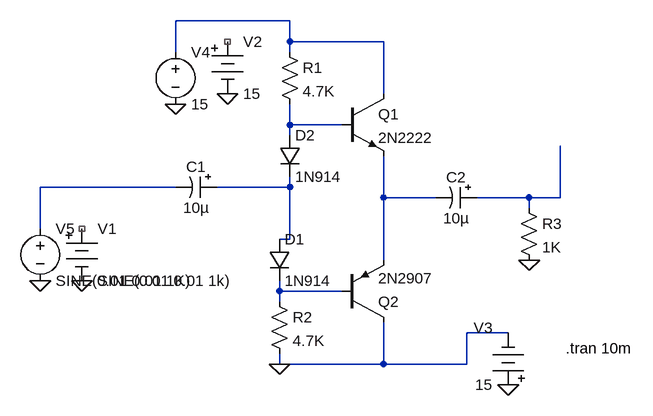
[diagram p0: schematic class b diode experiment 6.asc]
class b diode experiment 6.asc, the LTspice schematic file:
Version 4
SHEET 1 880 680
WIRE 320 -16 144 -16
WIRE 320 16 320 -16
WIRE 464 16 320 16
WIRE 144 32 144 -16
WIRE 320 32 320 16
WIRE 464 96 464 16
WIRE 320 144 320 112
WIRE 400 144 320 144
WIRE 320 160 320 144
WIRE 144 240 -64 240
WIRE 320 240 320 224
WIRE 320 240 208 240
WIRE 464 256 464 192
WIRE 544 256 464 256
WIRE 688 256 608 256
WIRE 736 256 736 176
WIRE 736 256 688 256
WIRE 688 272 688 256
WIRE -64 304 -64 240
WIRE 320 320 320 240
WIRE 320 320 304 320
WIRE 464 352 464 256
WIRE 304 400 304 384
WIRE 400 400 304 400
WIRE 304 416 304 400
WIRE 656 464 592 464
WIRE 304 512 304 496
WIRE 464 512 464 448
WIRE 464 512 304 512
WIRE 592 512 592 464
WIRE 592 512 464 512
FLAG 656 544 0
FLAG 304 512 0
FLAG 0 384 0
FLAG 224 96 0
FLAG 688 352 0
FLAG -64 384 0
FLAG 144 112 0
SYMBOL npn 400 96 R0
SYMATTR InstName Q1
SYMATTR Value 2N2222
SYMBOL polcap 208 224 R90
WINDOW 0 0 32 VBottom 2
WINDOW 3 32 32 VTop 2
SYMATTR InstName C1
SYMATTR Value 10µ
SYMATTR Description Capacitor
SYMATTR Type cap
SYMATTR SpiceLine Rser=4 Lser=0 mfg="AVX" pn="TAJA106M006" type="Tantalum"
SYMBOL polcap 608 240 R90
WINDOW 0 0 32 VBottom 2
WINDOW 3 32 32 VTop 2
SYMATTR InstName C2
SYMATTR Value 10µ
SYMATTR Description Capacitor
SYMATTR Type cap
SYMATTR SpiceLine Rser=4 Lser=0 mfg="AVX" pn="TAJA106M006" type="Tantalum"
SYMBOL diode 288 320 R0
SYMATTR InstName D1
SYMATTR Value 1N914
SYMBOL diode 304 160 R0
SYMATTR InstName D2
SYMATTR Value 1N914
SYMBOL res 304 16 R0
SYMATTR InstName R1
SYMATTR Value 4.7K
SYMBOL res 288 400 R0
SYMATTR InstName R2
SYMATTR Value 4.7K
SYMBOL res 672 256 R0
SYMATTR InstName R3
SYMATTR Value 1K
SYMBOL Misc/battery 0 288 R0
SYMATTR InstName V1
SYMATTR Value SINE(0.01 0.01 1k)
SYMATTR Value2 AC 0.01
SYMBOL Misc/battery 224 0 R0
SYMATTR InstName V2
SYMATTR Value 15
SYMBOL Misc/battery 656 560 R180
WINDOW 0 24 104 Left 2
WINDOW 3 24 16 Left 2
SYMATTR InstName V3
SYMATTR Value 15
SYMBOL voltage 144 16 R0
SYMATTR InstName V4
SYMATTR Value 15
SYMBOL voltage -64 288 R0
SYMATTR InstName V5
SYMATTR Value SINE(0.01 0.01 1K)
SYMBOL pnp 400 448 M180
SYMATTR InstName Q2
SYMATTR Value 2N2907
TEXT 744 488 Left 2 !.tran 10m

The netlist it stands for:
* class b diode experiment 6.asc
Q1 N001 N002 N005 0 2N2222
C1 N004 N003 10µ Rser=4 Lser=0 mfg="AVX" pn="TAJA106M006" type="Tantalum"
C2 N006 N005 10µ Rser=4 Lser=0 mfg="AVX" pn="TAJA106M006" type="Tantalum"
D1 N004 N007 1N914
D2 N002 N004 1N914
R1 N001 N002 4.7K
R2 N007 0 4.7K
R3 N006 0 1K
V1 NC_01 0 SINE(0.01 0.01 1k) AC 0.01
V2 NC_02 0 15
V3 0 0 15
V4 N001 0 15
V5 N003 0 SINE(0.01 0.01 1K)
Q2 0 N007 N005 0 2N2907
.model D D
.lib standard.dio
.model NPN NPN
.model PNP PNP
.lib standard.bjt
.tran 10m
.backanno
.end